# Altium schematic sheet clock2.SchDoc
size A4
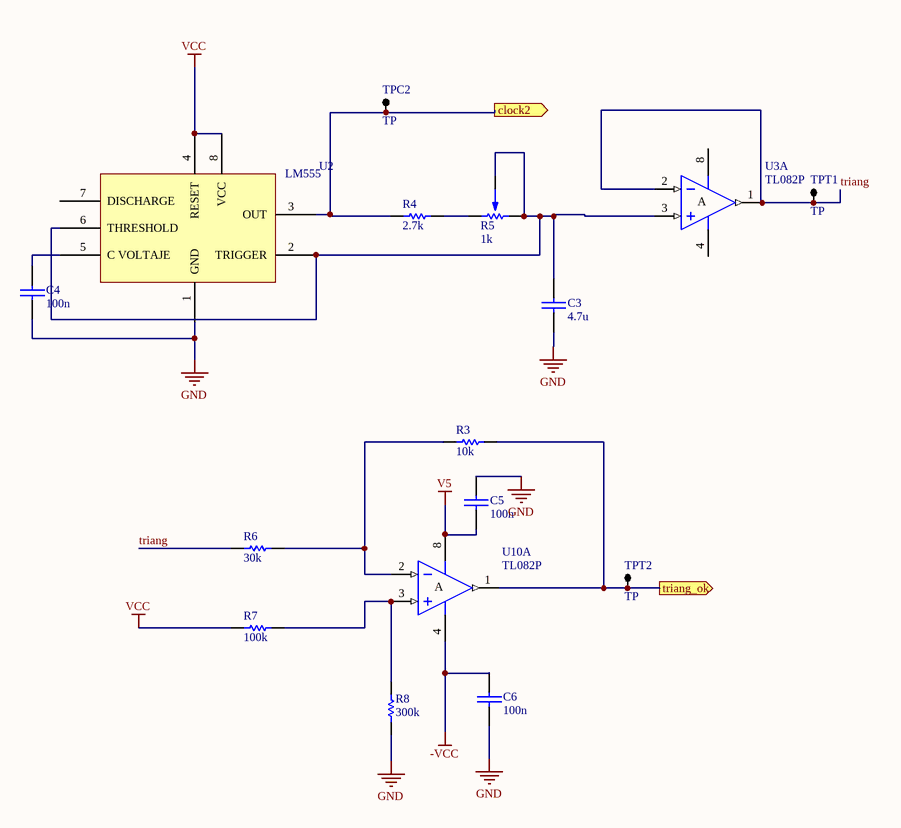
[diagram p0: clock2.SchDoc]

## Parts
C3  4.7u  [0805]
C4  100n  [CAP200]
C5  100n  [0805]
C6  100n  [0805]
R3  10k  [0805]
R4  2.7k  [RES400]
R5  1k  [PRESET H]
R6  30k  [0805]
R7  100k  [0805]
R8  300k  [0805]
TPC2  TP  [TPTH]
TPT1  TP  [TPTH]
TPT2  TP  [TPTH]
U2  LM555  [DIP8]
U3  TL082P  [P008]  (part A of 2)
U10  TL082P  [P008]  (part A of 2)

## Ports
clock2 (out), triang_ok (out)

## Nets
-VCC: C6.1 U10.4(V-)
GND: C3.2 C4.1 C5.1 C6.2 R8.1 U2.1(GND)
V5: C5.2 U10.8(V+)
VCC: R7.1 U2.4(RESET) U2.8(VCC)
clock2: R4.1 TPC2.1 U2.3(OUT) ; port clock2
triang: R6.1 TPT1.1 U3.1(OUT) U3.2(IN-)
triang_ok: R3.2 TPT2.1 U10.1(OUT) ; port triang_ok
NetC3_1: C3.1 R5.2 R5.3 U2.2(TRIGGER) U2.6(THRESHOLD) U3.3(IN+)
NetC4_2: C4.2 U2.5(C_VOLTAJE)
NetR3_1: R3.1 R6.2 U10.2(IN-)
NetR4_2: R4.2 R5.1
NetR7_2: R7.2 R8.2 U10.3(IN+)

Not connected (* = marked no-connect by the designer): U2 7(DISCHARGE); U3 4(V-) 8(V+)

## Notes on the sheet
- (in symbol TL082P, part A) A

## Library data of the parts
C3-C6 = CAP
R3 R4 R6-R8 = RES
R5 = PRESET
U2 = LM555: Timer
U3 U10 = TL082P: JFET-Input Operational Amplifier; Published: 16-Jan-2001; LatestRevisionDate: 04-Mar-2005; LatestRevisionNote: Stylized 3D Model Added.; DatasheetVersion: Feb-1999; PackageVersion: Jun-1999; PackageReference: P008; Publisher: Altium Limited; PackageDescription: DIP; 8 Leads; Row Spacing 7.62 mm; Pitch 2.54 mm; Code_JEDEC: MO-001-AN; ComponentLink1Description: Manufacturer Link; ComponentLink1URL: http://www.ti.com/; ComponentLink2Description: Datasheet; ComponentLink2URL: http://www-s.ti.com/sc/ds/tl082.pdf